# EAGLE design CAN_HB_AmbTempControl_V02 (EAGLE 4.09)
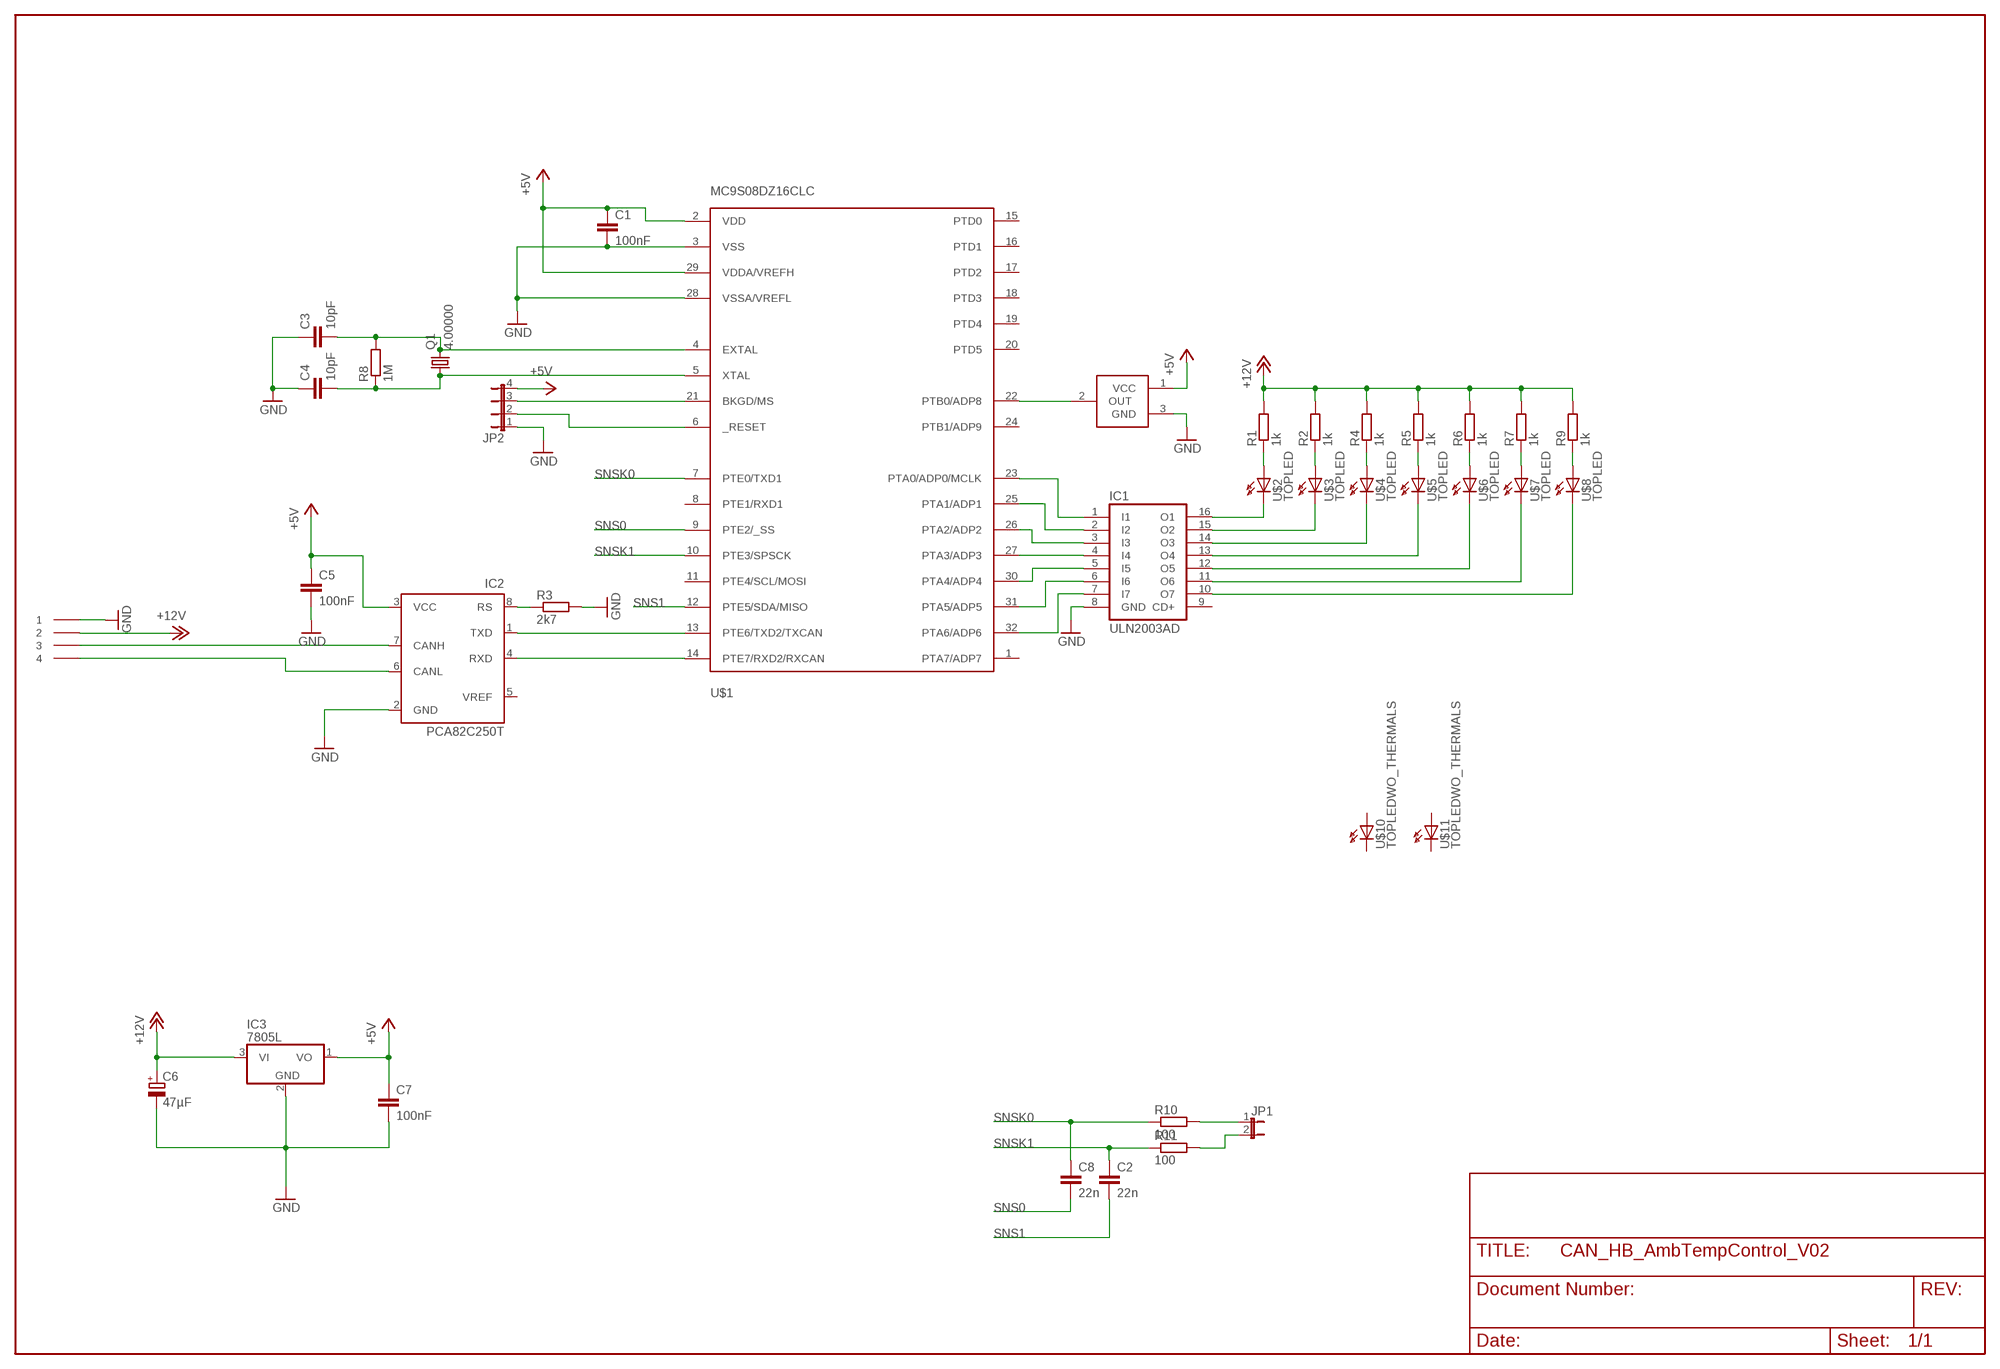
[diagram p0: schematic, sheet 1]

## Parts
C1  100nF  C-EUC0805K  [C0805K]
C2  22n  C-EUC0805  [C0805]
C3  10pF  C-EUC0805K  [C0805K]
C4  10pF  C-EUC0805K  [C0805K]
C5  100nF  C-EUC0805  [C0805]
C6  47µF  CPOL-EUE2-5  [E2-5]
C7  100nF  C-EUC0805K  [C0805K]
C8  22n  C-EUC0805  [C0805]
IC1  ULN2003AD  [SO16]
IC2  PCA82C250T  [SO8]
IC3  7805L  [TO92]
JP1  JP1E  [JP1]
JP2  JP4E  [JP4]
KL1  AST021-04  [AST021-04]
Q1  4.00000  CRYTALHC49U-V  [HC49U-V]
R1  1k  R-EU_R0805  [R0805]
R2  1k  R-EU_R0805  [R0805]
R3  2k7  R-EU_R0805  [R0805]
R4  1k  R-EU_R0805  [R0805]
R5  1k  R-EU_R0805  [R0805]
R6  1k  R-EU_R0805  [R0805]
R7  1k  R-EU_R0805  [R0805]
R8  1M  R-EU_R0805  [R0805]
R9  1k  R-EU_R0805  [R0805]
R10  100  R-EU_R0805  [R0805]
R11  100  R-EU_R0805  [R0805]
U$1  MC9S08DZ16CLC  [LQFP32]
U$2  TOPLED  [TOPLED]
U$3  TOPLED  [TOPLED]
U$4  TOPLED  [TOPLED]
U$5  TOPLED  [TOPLED]
U$6  TOPLED  [TOPLED]
U$7  TOPLED  [TOPLED]
U$8  TOPLED  [TOPLED]
U$9  LM35DZDZ  [TO92]
U$10  TOPLEDWO_THERMALS  [TOPLED_WO_THERMALS]
U$11  TOPLEDWO_THERMALS  [TOPLED_WO_THERMALS]

## Nets
+5V: C1.1 C5.1 C7.1 IC2.3(VCC) IC3.1(VO) JP2.4 U$1.2(VDD) U$1.29(VDDA/VREFH) U$9.1(VCC)
+12V: C6.+ IC3.3(VI) KL1.P$2 R1.2 R2.2 R4.2 R5.2 R6.2 R7.2 R9.2
GND: C1.2 C3.1 C4.1 C5.2 C6.- C7.2 IC1.8(GND) IC2.2(GND) IC3.2(GND) JP2.1 KL1.P$1 R3.2 U$1.3(VSS) U$1.28(VSSA/VREFL) U$9.3(GND)
N$1: IC2.1(TXD) U$1.13(PTE6/TXD2/TXCAN)
N$2: IC2.4(RXD) U$1.14(PTE7/RXD2/RXCAN)
N$3: IC2.8(RS) R3.1
N$4: IC2.6(CANL) KL1.P$4
N$5: IC1.4(I4) U$1.27(PTA3/ADP3)
N$6: IC1.5(I5) U$1.30(PTA4/ADP4)
N$7: IC2.7(CANH) KL1.P$3
N$8: IC1.6(I6) U$1.31(PTA5/ADP5)
N$9: C4.2 Q1.1 R8.1 U$1.5(XTAL)
N$10: C3.2 Q1.2 R8.2 U$1.4(EXTAL)
N$11: IC1.3(I3) U$1.26(PTA2/ADP2)
N$12: IC1.2(I2) U$1.25(PTA1/ADP1)
N$13: IC1.1(I1) U$1.23(PTA0/ADP0/MCLK)
N$14: IC1.7(I7) U$1.32(PTA6/ADP6)
N$15: U$1.22(PTB0/ADP8) U$9.2(OUT)
N$16: IC1.16(O1) U$2.C
N$17: IC1.15(O2) U$3.C
N$18: IC1.14(O3) U$4.C
N$19: IC1.13(O4) U$5.C
N$20: IC1.12(O5) U$6.C
N$21: JP2.2 U$1.6(_RESET)
N$22: JP2.3 U$1.21(BKGD/MS)
N$23: IC1.11(O6) U$7.C
N$25: IC1.10(O7) U$8.C
N$26: R9.1 U$8.A
N$27: R7.1 U$7.A
N$28: R6.1 U$6.A
N$29: R5.1 U$5.A
N$30: R4.1 U$4.A
N$31: R2.1 U$3.A
N$32: R1.1 U$2.A
N$46: JP1.1 R10.2
N$47: JP1.2 R11.2
SNS0: C8.2 U$1.9(PTE2/_SS)
SNS1: C2.2 U$1.12(PTE5/SDA/MISO)
SNSK0: C8.1 R10.1 U$1.7(PTE0/TXD1)
SNSK1: C2.1 R11.1 U$1.10(PTE3/SPSCK)
Unconnected: IC1.9(CD+) IC2.5(VREF) U$1.1(PTA7/ADP7) U$1.8(PTE1/RXD1) U$1.11(PTE4/SCL/MOSI) U$1.15(PTD0) U$1.16(PTD1) U$1.17(PTD2) U$1.18(PTD3) U$1.19(PTD4) U$1.20(PTD5) U$1.24(PTB1/ADP9) U$10.A U$10.C U$11.A U$11.C

## Library data of the parts
C1-C5 C7 C8 = rcl:C-EU: CAPACITOR, European symbol
C6 = rcl:CPOL-EU: POLARIZED CAPACITOR, European symbol
IC1 = uln-udn:ULN2003A: DRIVER ARRAY
IC2 = micro-philips:PCA82C250: CAN CONTROLLER INTERFACE
IC3 = linear:78*: Positive VOLTAGE REGULATOR
JP1 = jumper:JP1E: JUMPER
JP2 = jumper:JP4E: JUMPER
KL1 = con-ria:AST021-04
Q1 = crystal:CRYTAL: CRYSTAL
R1-R11 = rcl:R-EU_: RESISTOR, European symbol
U$1 = MC9S08DZ16CLC:MC9S08DZ16CLC
U$2-U$8 U$10 U$11 = led:TOPLED
U$9 = linear:LM35DZ

## Board
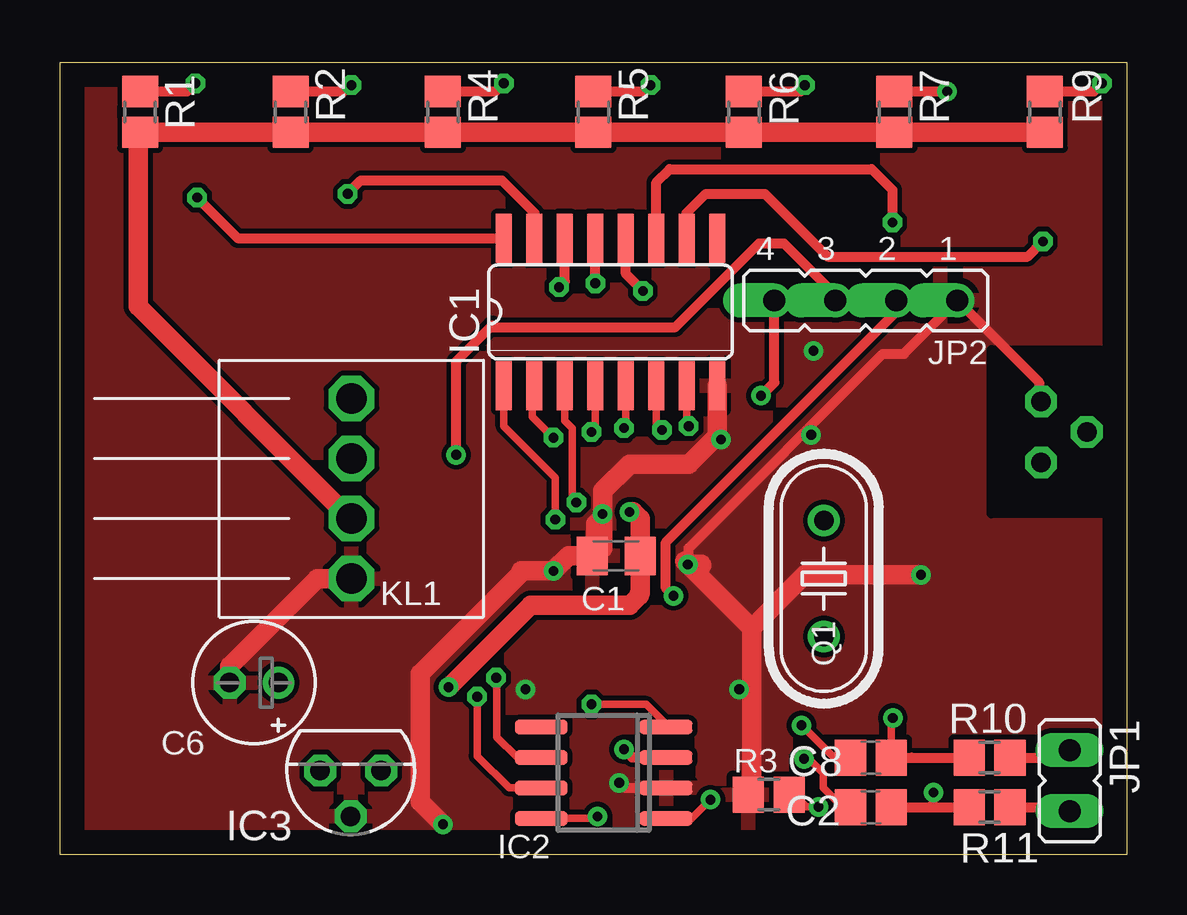
[diagram p1: board, top side]
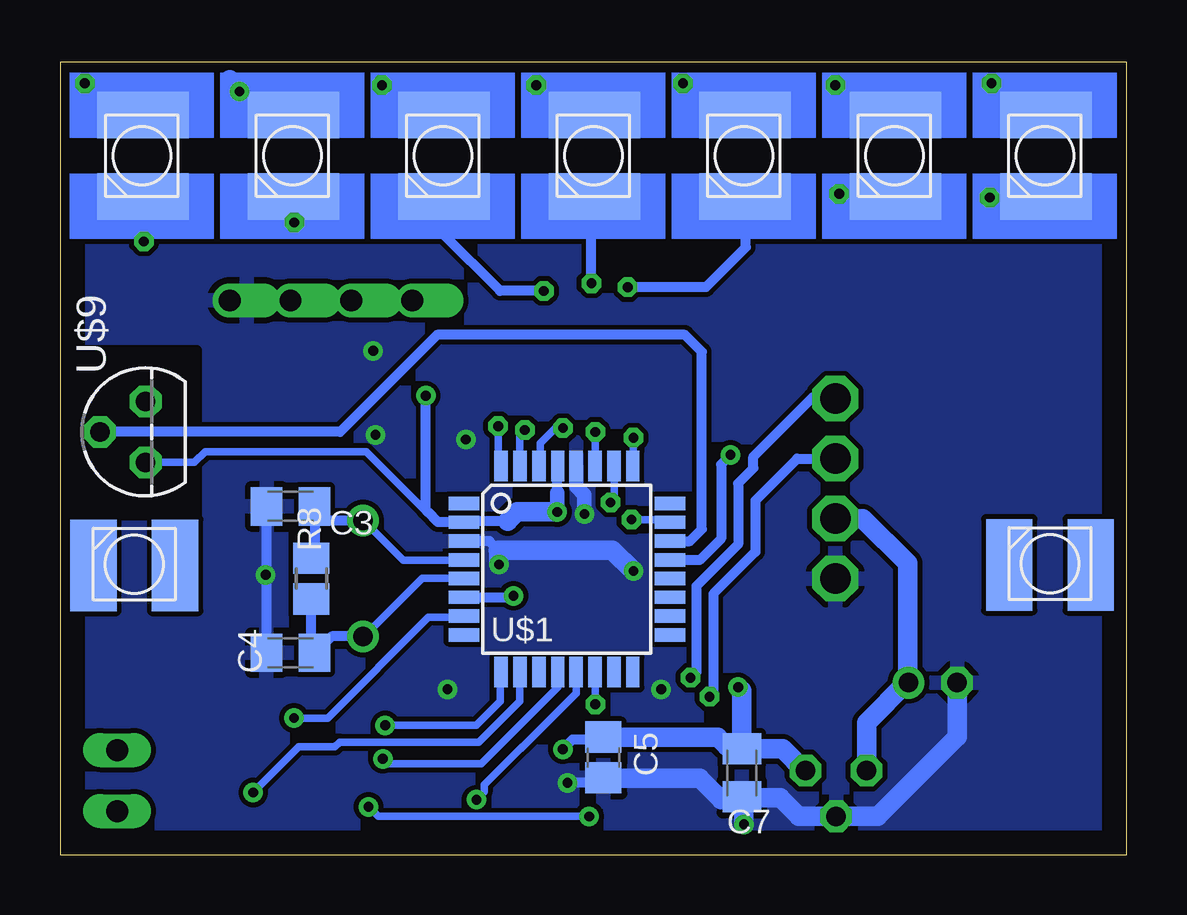
[diagram p2: board, bottom side, seen from below]

Size 44.45 x 33.02 mm. Coordinates in mm from the lower left corner, seen from the top.
Outline: 0,33.02 44.45,33.02 44.45,0 0,0 0,33.02
Copper layers used: Top, Bottom
tRestrict: area 38.8,14.2 to 44,21.1
bRestrict: area 38.7,14.2 to 44,21

### Footprints (pad centres in the part's own frame; a part is rotated, then mirrored left to right if it is on the bottom)
C0805K = smd 1.3 x 1.6: 1 -1,0; 2 1,0
C0805 = smd 1.3 x 1.5: 1 -0.85,0; 2 0.85,0
E2-5 = drill 0.813 pad 1.27 round: + -1.016,0 | drill 0.813 pad 1.27 octagon: - 1.016,0
SO16 = smd 0.66 x 2.032: 1 -4.445,-3.073; 2 -3.175,-3.073; 3 -1.905,-3.073; 4 -0.635,-3.073; 5 0.635,-3.073; 6 1.905,-3.073; 7 3.175,-3.073; 8 4.445,-3.073; 9 4.445,3.073; 10 3.175,3.073; 11 1.905,3.073; 12 0.635,3.073; 13 -0.635,3.073; 14 -1.905,3.073; 15 -3.175,3.073; 16 -4.445,3.073
SO8 = smd 0.6 x 2.2: 1 -1.905,-2.6; 2 -0.635,-2.6; 3 0.635,-2.6; 4 1.905,-2.6; 5 1.905,2.6; 6 0.635,2.6; 7 -0.635,2.6; 8 -1.905,2.6
TO92 = drill 0.813 octagon: 1 -1.27,0; 2 0,1.905; 3 1.27,0
JP1 = drill 0.914 long: 1 0,-1.27; 2 0,1.27
JP4 = drill 0.914 offset: 1 -3.81,0; 2 -1.27,0; 3 1.27,0; 4 3.81,0
AST021-04 = drill 1.27 octagon: P$1 0,0; P$2 0,2.5; P$3 0,5; P$4 0,7.5
HC49U-V = drill 0.813 round: 1 -2.413,0; 2 2.413,0
R0805 = smd 1.3 x 1.5: 1 -0.85,0; 2 0.85,0
LQFP32 = smd 1.27 x 0.559: 1 -4.293,2.743; 2 -4.293,1.956; 3 -4.293,1.168; 4 -4.293,0.381; 5 -4.293,-0.381; 6 -4.293,-1.168; 7 -4.293,-1.956; 8 -4.293,-2.743; 17 4.293,-2.743; 18 4.293,-1.956; 19 4.293,-1.168; 20 4.293,-0.381; 21 4.293,0.381; 22 4.293,1.168; 23 4.293,1.956; 24 4.293,2.743 | smd 0.559 x 1.27: 9 -2.743,-4.293; 10 -1.956,-4.293; 11 -1.168,-4.293; 12 -0.381,-4.293; 13 0.381,-4.293; 14 1.168,-4.293; 15 1.956,-4.293; 16 2.743,-4.293; 25 2.743,4.293; 26 1.956,4.293; 27 1.168,4.293; 28 0.381,4.293; 29 -0.381,4.293; 30 -1.168,4.293; 31 -1.956,4.293; 32 -2.743,4.293
TOPLED = smd 3.81 x 1.93: A 0.05,1.7; C 0.05,-1.7
TOPLED_WO_THERMALS = smd 3.81 x 1.93: A -1.22,1.7; C -1.22,-1.7

### Placement (x,y rotation side)
C1  23.17,12.46 180 top
C2  33.79,1.98 180 top
C3  34.84,14.52 0 bottom
C4  34.85,8.42 0 bottom
C5  21.81,4.06 270 bottom
C6  8.09,7.17 180 top
C7  16.04,3.42 270 bottom
C8  33.79,4.05 180 top
IC1  22.94,22.62 0 top
IC2  22.65,3.42 90 top
IC3  12.11,3.51 180 top
JP1  42.07,3.1 180 top
JP2  33.58,23.1 180 top
KL1  12.14,11.51 0 top
Q1  31.82,11.51 90 top
R1  3.33,30.96 270 top
R2  9.6,30.96 270 top
R3  29.53,2.51 180 top
R4  15.95,30.96 270 top
R5  22.23,30.96 270 top
R6  28.5,30.96 270 top
R7  34.77,30.96 270 top
R8  33.97,11.51 90 bottom
R9  41.04,30.96 270 top
R10  38.73,4.05 0 top
R11  38.73,1.98 0 top
U$1  23.33,11.9 0 bottom
U$2  3.41,29.13 0 bottom
U$3  9.68,29.13 0 bottom
U$4  15.95,29.13 0 bottom
U$5  22.23,29.13 0 bottom
U$6  28.5,29.13 0 bottom
U$7  34.77,29.13 0 bottom
U$8  41.04,29.13 0 bottom
U$9  40.88,17.62 90 bottom
U$10  41.35,10.84 270 bottom
U$11  3.2,10.86 270 bottom

### Tracks (layer width: path | path; a pad name or v marks a point on that pad's centre or on a via)
+5V  (via drill 0.41)
  Top 0.406: v29.21,19.13 29.69,19.61 | 29.69,19.61 | 29.69,19.61 29.77,19.68 JP2.4 | IC2.3 23.84,4.06 v23.5,4.4
  Top 0.813: v23.73,14.29 23.89,14.29 24.17,14.01 C1.1 24.17,10.92 24.13,10.87 24.13,10.8 23.73,10.4 19.61,10.4 v16.19,6.99
  Bottom 0.305: U$9.1 38.85,16.35 38.4,16.8 31.7,16.8 29.19,14.29 29.13,14.29
  Bottom 0.406: U$1.29 23.73,16.19 23.73,15.08 | 27.62,13.81 | 27.62,13.81 U$1.2 28.7,13.86 29.13,14.29 29.21,14.37 v29.21,19.13 | 25.8,13.89 27.54,13.89 27.62,13.81 | C5.1 21.8,4.8 23.1,4.8 v23.5,4.4 | U$9.1
  Bottom 0.61: v23.73,14.29 23.73,15.08
  Bottom 0.813: v23.73,14.29 25.4,14.29 25.8,13.89 | C7.1 16.16,4.42 16.27,4.52 16.67,4.52 17.04,4.9 C5.1 | IC3.1 13.4,3.51 13.41,3.49 14.34,4.42 C7.1 | C7.1 16.04,6.83 v16.19,6.99 | C5.1 | C5.1
+12V
  Top 0.813: R9.2 34.87,30.11 34.85,30.16 34.82,30.19 R7.2 28.79,30.11 28.73,30.24 28.68,30.19 R6.2 22.25,30.11 22.23,30.16 R5.2 R4.2 | R4.2 15.9,30.19 15.88,30.16 | 9.6,30.16 | 9.6,30.16 R2.2 3.52,30.11 3.49,30.08 3.47,30.19 R1.2 3.28,30.24 3.25,30.24 3.25,22.86 12.14,13.97 | R4.2 9.63,30.11 9.6,30.16 | 12.14,13.97 KL1.P$2 | 12.14,13.97 12.14,13.89
  Bottom 0.813: KL1.P$2 10.99,14.01 9.13,12.14 9.13,7.3 9.05,7.22 C6.+ 9.1,7.2 9.13,7.22 10.84,5.51 IC3.3
GND  (via drill 0.41)
  Top 0.305: 28.3,2.19 28.63,2.51 R3.2 28.7,2.49 28.7,2.4 28.8,2.4 28.81,2.38
  Top 0.406: 27.3,17.46 27.46,17.62 | 27.38,17.46 27.3,17.46 | 27.3,17.46 27.23,17.38 | 26.19,12.07 26.19,12.78 34.29,20.88 35.16,20.88 JP2.1 40.8,19.68 40.8,18.89 U$9.3 | U$9.3 | 25.27,2.8 25.3,2.8 | 25.27,2.8 IC2.2 | v23.3,3 23.5,2.8 25.27,2.8
  Top 0.61: C1.2 22.23,12.46 22.23,13.81 22.62,14.21 22.69,14.21 22.7,14.2 v22.6,14.2 22.6,13.7
  Top 0.813: 27.38,17.46 IC1.8 | 27.38,17.46 26.19,16.27 23.73,16.27 22.62,15.16 22.62,14.21 22.62,12.78 22.3,12.46 22.23,12.46 21.19,12.46 v20.56,11.83 19.21,11.83 19.21,11.75 15,7.54 15,2.22 v15.95,1.27 | 28.62,2.19 28.81,2.38 28.81,9.45 | 26.75,12.07 26.71,12.1 v26.16,12.1 26.11,12.14 | 11.35,11.51 KL1.P$1 10.71,11.51 7.07,7.86 C6.- | 26.11,12.14 26.04,12.22 | 26.11,12.14 26.19,12.07 28.81,9.45 | 28.81,9.45 31.04,11.67 v35.88,11.67 | 27.38,17.46 v27.54,17.3
  Bottom 0.305: C4.1 35.8,8.41 35.8,11.59 v35.88,11.67
  Bottom 0.406: U$1.3 26.57,13.07 26.19,12.7 | 35.8,8.41 35.8,8.42 | 35.8,8.42 C4.1 | C3.1 35.84,8.46 35.8,8.42 | C5.2 22.02,3 v23.3,3
  Bottom 0.61: U$1.28 22.95,15.35 22.6,15 v22.6,14.2
  Bottom 0.813: 26.11,12.7 21.43,12.7 v20.56,11.83 | 26.11,12.7 26.19,12.7 | v26.16,12.1 26.16,12.65 26.11,12.7 | C6.- 7.07,6.43 7.06,6.43 7.06,4.92 10.38,1.61 IC3.2 13.67,1.61 14.45,2.38 15.95,2.38 | 15.95,2.38 15.99,2.42 C7.2 16.78,2.42 16.9,2.3 17.8,3.2 21.9,3.2 21.89,3.21 C5.2 | v15.95,1.27 15.95,2.38
  other vias: 31.4,21 31.3,17.5 19.4,6.9 28.3,6.9
  pour Top: 44.53,32.54 44.53,-0.08 0.24,-0.08 0.24,32.62 44.45,32.62
  pour Bottom: 44.45,-0.08 44.45,32.7 0.16,32.7 0.16,0 44.29,0
N$1  (via drill 0.41)
  Top 0.305: IC2.1 25.27,1.5 26.3,1.5 v27.1,2.3
  Bottom 0.305: U$1.13 22.95,6.74 25.24,4.45 25.24,4.46 | v27.1,2.3 26.78,2.62 26.78,2.92 25.24,4.46 | 25.24,4.46 25.2,4.5
N$2  (via drill 0.41)
  Top 0.305: IC2.4 25.25,5.35 25.3,5.4 24.43,6.27 v22.15,6.27
  Bottom 0.305: U$1.14 22.15,7.61 v22.15,6.27
N$3  (via drill 0.41)
  Top 0.305: IC2.8 22.32,1.52 v22.4,1.6 | R3.1 30.41,2.51 30.5,2.6 31.1,2 v31.6,2
  Bottom 0.305: v22.4,1.6 31.2,1.6 v31.6,2
N$4  (via drill 0.41)
  Top 0.305: IC2.6 19.04,4.06 18.2,4.9 18.2,7.3 18.18,7.32 v18.18,7.38
  Bottom 0.406: KL1.P$4 12.26,19.01 12.3,19.05 13.1,19.05 15.56,16.59 15.56,16.11 16.19,15.48 16.19,12.94 17.94,11.19 17.94,7.62 v18.18,7.38 | v18.18,7.38
N$5  (via drill 0.41)
  Top 0.305: v22.15,17.62 22.3,17.78 IC1.4
  Bottom 0.305: U$1.27 22.15,16.21 v22.15,17.62
N$6  (via drill 0.41)
  Top 0.305: IC1.5 23.57,17.86 v23.5,17.78
  Bottom 0.305: v23.5,17.78 23.81,17.78 24.45,17.15 24.45,16.27 24.5,16.22 U$1.30
N$7  (via drill 0.41)
  Top 0.305: v17.38,6.59 17.38,4.12 18.71,2.79 IC2.7
  Bottom 0.406: KL1.P$3 13.73,16.51 15.48,14.76 15.48,12.62 17.22,10.87 17.22,6.75 v17.38,6.59
N$8  (via drill 0.41)
  Top 0.305: v25.08,17.7 24.84,17.94 IC1.6
  Bottom 0.305: U$1.31 25.29,17.5 v25.08,17.7
N$9
  Bottom 0.305: Q1.1 31.78,9.1 29.36,11.52 U$1.5
  Bottom 0.406: 33.82,8.42 33.81,8.41 | 33.82,8.42 C4.2 33.85,8.38 | R8.1 33.97,8.57 33.82,8.42 | 33.85,8.38 33.89,8.33 | Q1.1 33.13,9.1 33.85,8.38
N$10
  Bottom 0.305: Q1.2 31.78,13.93 30.14,12.28 U$1.4
  Bottom 0.406: 33.89,14.52 33.89,14.53 | 33.89,14.52 C3.2 33.84,12.43 33.92,12.36 R8.2 | Q1.2 33.29,13.93 33.89,14.52
N$11  (via drill 0.41)
  Top 0.305: IC1.3 21.03,18.1 21.35,17.78 21.35,14.84 v21.51,14.68
  Bottom 0.305: U$1.26 21.35,16.17 21.35,14.84 v21.51,14.68
N$12  (via drill 0.41)
  Top 0.305: 19.69,19.63 19.69,19.69 | 19.69,19.63 IC1.2 | v20.56,17.38 19.69,18.26 19.69,19.63
  Bottom 0.305: U$1.25 20.56,16.22 v20.56,17.38
N$13  (via drill 0.41)
  Top 0.305: IC1.1 18.49,17.86 20.64,15.72 v20.64,13.97
  Bottom 0.305: U$1.23 18.97,13.93 18.97,13.97 v20.64,13.97 20.72,13.97
N$14  (via drill 0.41)
  Top 0.305: IC1.7 26.11,17.94 v26.19,17.86
  Bottom 0.305: 26.04,16.2 26.04,16.19 | U$1.32 26.04,16.2 | v26.19,17.86 26.19,16.35 26.04,16.2
N$15
  Bottom 0.406: U$1.22 18.2,13.07 17.7,13.57 17.7,20.96 18.41,21.67 28.73,21.67 32.78,17.62 42.7,17.62 42.78,17.54 | 42.78,17.54 | 42.78,17.54 U$9.2
N$16  (via drill 0.41)
  Top 0.406: IC1.16 7.4,25.7 v5.71,27.38
  Bottom 0.406: U$2.C 3.6,27.43 3.73,27.31 3.81,27.38 v5.71,27.38
N$17  (via drill 0.41)
  Top 0.406: IC1.15 19.76,26.75 18.41,28.1 12.54,28.1 v11.99,27.54
  Bottom 0.406: U$3.C 9.57,27.43 9.68,27.54 v11.99,27.54
N$18  (via drill 0.41)
  Top 0.406: IC1.14 21.03,23.89 v20.8,23.65
  Bottom 0.406: v20.8,23.65 17.54,23.65 15.88,25.32 15.88,27.3 15.95,27.38 U$4.C
N$19  (via drill 0.41)
  Top 0.406: v22.3,23.82 IC1.13
  Bottom 0.406: 22.18,27.31 22.15,27.31 | 22.18,27.31 U$5.C | v22.3,23.82 22.3,27.31 22.18,27.31
N$20  (via drill 0.41)
  Top 0.406: IC1.12 23.57,24.21 v24.29,23.5
  Bottom 0.406: v24.29,23.5 26.11,23.5 28.5,25.88 28.5,27.15 28.42,27.23 28.45,27.25 U$6.C
N$21  (via drill 0.41)
  Top 0.406: v25.56,10.8 25.24,11.11 25.24,13.02 34.85,22.62 JP2.2
  Bottom 0.406: U$1.6 25.62,10.73 v25.56,10.8
N$22  (via drill 0.41)
  Top 0.406: v16.51,16.67 16.51,20.56 18.02,22.07 18.02,21.99 25.64,21.99 29.13,25.48 30.16,25.48 32.31,23.34 JP2.3
  Bottom 0.406: U$1.21 17.8,12.28 16.91,13.18 16.91,16.27 v16.51,16.67
N$23  (via drill 0.41)
  Top 0.406: IC1.11 24.84,28.02 25.4,28.58 33.81,28.58 34.69,27.7 v34.69,26.35
  Bottom 0.406: U$7.C 34.72,26.38 v34.69,26.35
N$25  (via drill 0.41)
  Top 0.406: IC1.10 26.11,26.75 26.91,27.54 29.37,27.54 31.99,24.92 40.32,24.92 v40.96,25.56
  Bottom 0.406: U$8.C 40.99,27.41 40.96,27.38 v40.96,25.56
N$26  (via drill 0.41)
  Top 0.406: R9.1 43.08,31.81 v43.42,32.15
  Bottom 0.406: U$8.A 40.99,30.93 40.96,30.96 42.15,32.15 v43.42,32.15
N$27  (via drill 0.41)
  Top 0.406: R7.1 v36.97,31.81
  Bottom 0.406: U$7.A 34.73,30.83 34.77,30.8 36.27,32.31 37.39,32.31
  Bottom 0.813: v36.97,31.81 | 37.39,32.31 37.39,32.23 v36.97,31.81
N$28  (via drill 0.41)
  Top 0.406: R6.1 30.85,31.81 v31.04,32.07
  Bottom 0.406: U$6.A 28.45,30.99 29.53,32.07 v31.04,32.07
N$29  (via drill 0.41)
  Top 0.406: R5.1 24.35,31.81 v24.61,32.07
  Bottom 0.406: U$5.A 22.19,30.83 22.23,30.8 23.5,32.07 v24.61,32.07
N$30  (via drill 0.41)
  Top 0.406: R4.1 18.15,31.81 v18.49,32.15
  Bottom 0.406: 15.75,30.83 15.72,30.8 | 15.75,30.83 U$4.A | v18.49,32.15 17.07,32.15 15.75,30.83
N$31  (via drill 0.41)
  Top 0.406: R2.1 11.8,31.81 v12.14,32.07
  Bottom 0.406: U$3.A 9.56,30.83 10.79,32.07 v12.14,32.07
N$32  (via drill 0.41)
  Top 0.406: R1.1 5.29,31.81 v5.64,32.15
  Bottom 0.406: U$2.A 3.28,30.85 3.25,30.88 4.52,32.15 v5.64,32.15
N$46
  Top 0.406: JP1.1 | R10.2 41.75,4.05 JP1.1
N$47
  Top 0.406: JP1.2 41.99,1.83 41.83,1.98 R11.2
SNS0  (via drill 0.41)
  Top 0.305: v30.9,5.4 32.25,4.05 32.9,4 C8.2
  Bottom 0.305: v30.9,5.4 27.1,5.4 26.1,6.4 26.1,7.5 26.07,7.53 U$1.9
SNS1  (via drill 0.41)
  Top 0.305: v31,4 31.2,4 31.8,3.4 31.8,2.8 32.61,1.98 C2.2
  Top 0.813: C2.2 32.94,1.96 32.99,1.91
  Bottom 0.305: v31,4 30.8,3.8 26.9,3.8 23.71,6.99 U$1.12
SNSK0  (via drill 0.41)
  Top 0.305: 35.48,4.1 C8.1 34.64,5.64 v34.7,5.7
  Top 0.406: 37.86,4.05 | 37.86,4.05 R10.1 | C8.1 37.86,4.05 | 37.86,4.05
  Bottom 0.305: v34.7,5.7 33.3,5.7 29.1,9.9 27.7,9.9 27.65,9.95 U$1.7
SNSK1  (via drill 0.41)
  Top 0.305: C2.1 36.2,2 36.4,2.2 v36.4,2.6
  Top 0.406: 37.86,1.98 R11.1 | C2.1 37.86,1.98 | 37.86,1.98
  Bottom 0.305: v36.4,2.6 34.5,4.5 33,4.5 32.8,4.7 27,4.7 25.3,6.4 U$1.10